# Altium schematic sheet LPS 3.3v 1A (12V) AZ1117H-3.3TRE1.SchDoc
size 209 x 297 mm; Author: Мурашкин Д.В.; Address1: Address1; Address2: Address2; Address3: Address3; Address4: Address4; DocumentNumber: SS19946-01; Scale: 1:1; Letter1Column: Э; PartName: Регулятор напряжения
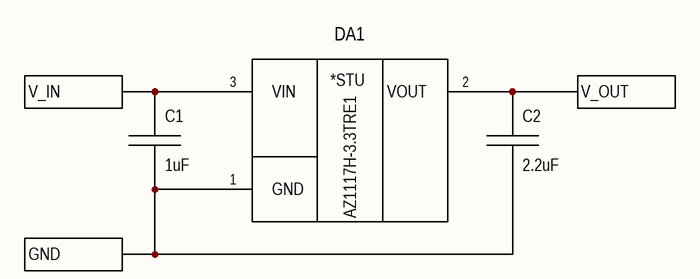
[diagram p0: LPS 3.3v 1A (12V) AZ1117H-3.3TRE1.SchDoc]

## Parts
C1  1uF  [CAPC1608L]
C2  2.2uF  [CAPC2012L]
DA1  AZ1117H-3.3TRE1  [SOT-223]

## Ports
GND, V_IN, V_OUT

## Nets
GND: C1.2 C2.2 DA1.1(GND) ; port GND
V_IN: C1.1 DA1.3(VIN) ; port V_IN
V_OUT: C2.1 DA1.2(VOUT) ; port V_OUT

## Notes on the sheet
- Перв. примен.
- Справ. №
- Подп. и дата
- Инв. № дубл.
- Взам. инв. №
- Разраб.
- Изм.
- Лист
- № докум.
- Подп.
- Дата
- Лит.
- Масса
- Масштаб
- Пров.
- Т.контр.
- Листов
- Инв. № подл.
- Утв.
- Н.контр.
- 2.106-A4
- Копировал
- Формат А4
- (in symbol AZ1117H-3.3TRE1) *STU

## Library data of the parts
C1 = Capacitor Ceramic 1uF 25V 0603(1608): Group: Ceramic Capacitors; Temperature Coefficient: X5R; Tolerance: ±10%; Short description: CAP CER 1UF 25V X5R 0603; Type: Ceramic; Voltage: 25V; Package: 0603 (1608); Value: 1uF
C2 = Capacitor Ceramic 2.2uF 50V 0805(2012): Group: Ceramic Capacitors; Temperature Coefficient: X5R; Tolerance: ±10%; Type: Ceramic; Voltage: 50V; Package: 0805 (2012); Value: 2.2uF
DA1 = AZ1117H-3.3TRE1: LDO 1A 3.3V (15V); Manufacturer: Diodes Incorporated; Group: PMIC - Voltage Regulators - Linear; Package: SOT-223; Part name: AZ1117H-3.3TRE1